# EAGLE schematic Preamp (EAGLE 6.2)
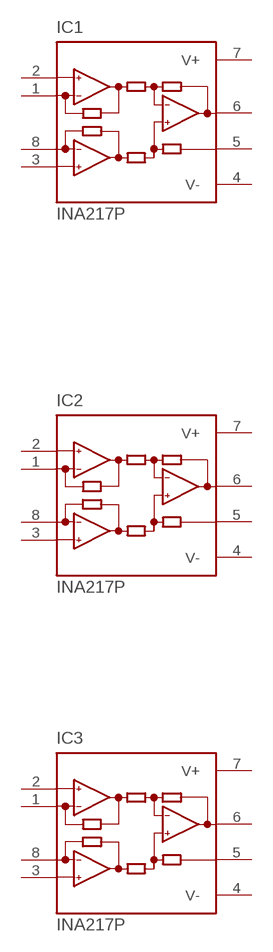
[diagram p0: schematic, sheet 1]

## Parts
IC1  INA217P  [DIL08]
IC2  INA217P  [DIL08]
IC3  INA217P  [DIL08]
Unconnected: IC1.1(RG1) IC1.2(-IN) IC1.3(+IN) IC1.5(REF) IC1.6(OUT) IC1.8(RG2) IC2.1(RG1) IC2.2(-IN) IC2.3(+IN) IC2.5(REF) IC2.6(OUT) IC2.8(RG2) IC3.1(RG1) IC3.2(-IN) IC3.3(+IN) IC3.5(REF) IC3.6(OUT) IC3.8(RG2)

## Power pins joined to a net without a drawn wire
V+: IC1.7(V+) IC2.7(V+) IC3.7(V+)
V-: IC1.4(V-) IC2.4(V-) IC3.4(V-)

## Library data of the parts
IC1-IC3 = burr-brown:INA217: Low-Noise, Low-Distortion INSTRUMENTATION AMPLIFIER Replacement for SSM2017 Source: http://focus.ti.com/lit/ds/symlink/ina217.pdf; MF: TEXAS INSTRUMENTS; MPN: INA217AIP; OC_FARNELL: 1212423; OC_NEWARK: 74C9859